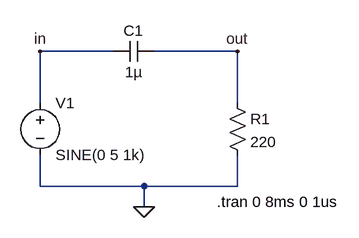
[diagram p0: schematic 1k_exp 09.asc]
1k_exp 09.asc, the LTspice schematic file:
Version 4
SHEET 1 880 680
WIRE 192 64 80 64
WIRE 384 64 256 64
WIRE 80 144 80 64
WIRE 384 144 384 64
WIRE 80 272 80 224
WIRE 240 272 80 272
WIRE 384 272 384 224
WIRE 384 272 240 272
WIRE 240 304 240 272
FLAG 240 304 0
FLAG 80 64 in
FLAG 384 64 out
SYMBOL voltage 80 128 R0
WINDOW 123 0 0 Left 0
WINDOW 39 0 0 Left 0
SYMATTR InstName V1
SYMATTR Value SINE(0 5 1k)
SYMBOL res 368 128 R0
SYMATTR InstName R1
SYMATTR Value 220
SYMBOL cap 256 48 R90
WINDOW 0 0 32 VBottom 2
WINDOW 3 32 32 VTop 2
SYMATTR InstName C1
SYMATTR Value 1µ
TEXT 352 296 Left 2 !.tran 0 8ms 0 1us

The netlist it stands for:
* 1k_exp 09.asc
V1 in 0 SINE(0 5 1k)
R1 out 0 220
C1 out in 1µ
.tran 0 8ms 0 1us
.backanno
.end

* Results of the author's LTspice run, read from the files saved beside the schematic
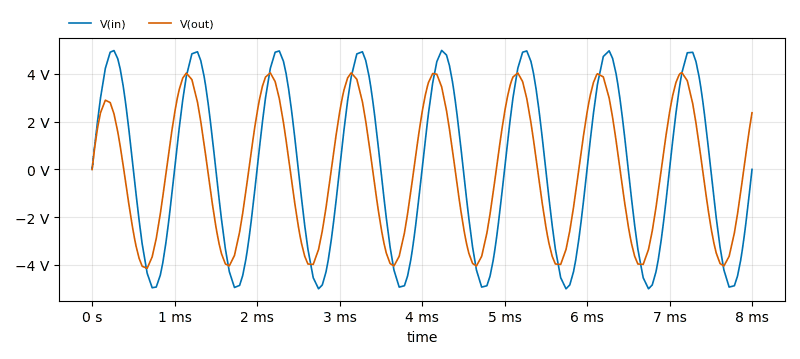
[diagram p1: Transient Analysis of 1k_exp 09.asc, plotted from the saved traces]
* Transient Analysis, 1 run:
*   V(in): min -4.998 V, max 4.985 V, average 94.43 µV, rms 3.518 V, last 0 V
*   V(out): min -4.14 V, max 4.051 V, average -65.33 mV, rms 2.81 V, last 2.374 V